# Altium project science-26.PrjPcb
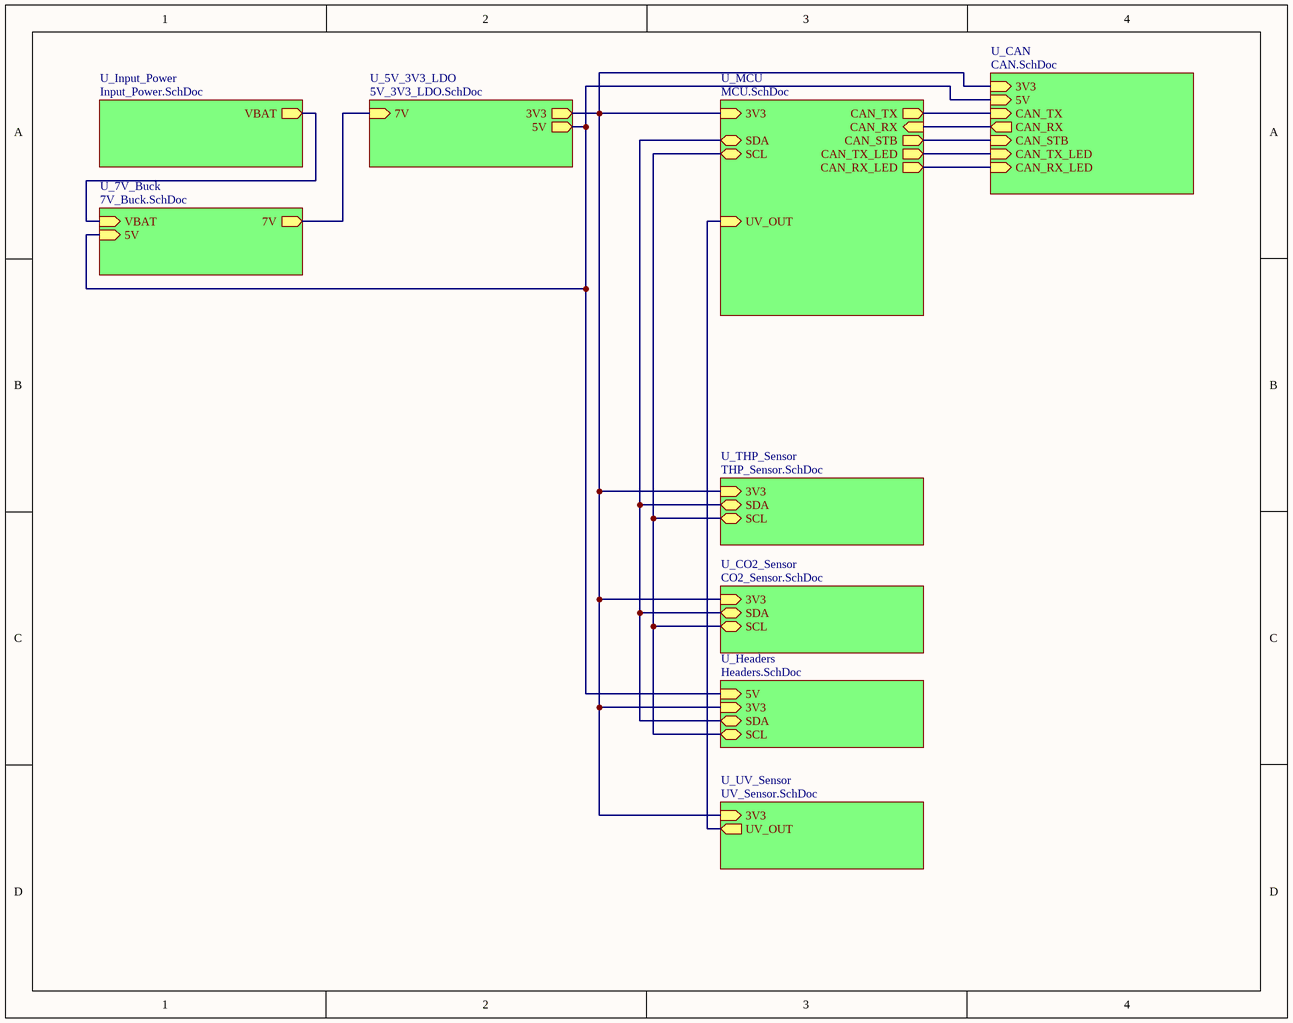
[diagram p0: TLD.SchDoc]
10 sheets, 101 parts. Net scope: hierarchical (ports join the sheet entries above them; power ports are global).
Board file: science-26.PcbDoc
Sheets:
  TLD.SchDoc
    U_5V_3V3_LDO = 5V_3V3_LDO.SchDoc
    U_7V_Buck = 7V_Buck.SchDoc
    U_CAN = CAN.SchDoc
    U_CO2_Sensor = CO2_Sensor.SchDoc
    U_Input_Power = Input_Power.SchDoc
    U_MCU = MCU.SchDoc
    U_THP_Sensor = THP_Sensor.SchDoc
    U_UV_Sensor = UV_Sensor.SchDoc
    U_Headers = Headers.SchDoc

## Sheet TLD.SchDoc
size A; SheetNumber: 1; SheetTotal: 10

### Sub-sheets
U_5V_3V3_LDO = 5V_3V3_LDO.SchDoc: 3V3 (out), 5V (out), 7V (in)
U_7V_Buck = 7V_Buck.SchDoc: 7V (out), VBAT (in), 5V (in)
U_CAN = CAN.SchDoc: CAN_TX (in), CAN_RX (out), CAN_STB (in), CAN_TX_LED (in), CAN_RX_LED (in), 3V3 (in), 5V (in)
U_CO2_Sensor = CO2_Sensor.SchDoc: 3V3 (in), SDA (bidir), SCL (bidir)
U_Headers = Headers.SchDoc: SDA (bidir), SCL (bidir), 3V3 (in), 5V (in)
U_Input_Power = Input_Power.SchDoc: VBAT (out)
U_MCU = MCU.SchDoc: SDA (bidir), SCL (bidir), 3V3 (in), CAN_TX (out), CAN_RX (in), CAN_STB (out), CAN_TX_LED (out), CAN_RX_LED (out), UV_OUT (in)
U_THP_Sensor = THP_Sensor.SchDoc: SDA (bidir), SCL (bidir), 3V3 (in)
U_UV_Sensor = UV_Sensor.SchDoc: 3V3 (in), UV_OUT (out)

### Nets
3V3: sheet U_5V_3V3_LDO/3V3, sheet U_CAN/3V3, sheet U_CO2_Sensor/3V3, sheet U_MCU/3V3, sheet U_THP_Sensor/3V3, sheet U_UV_Sensor/3V3, sheet U_Headers/3V3
5V: sheet U_5V_3V3_LDO/5V, sheet U_7V_Buck/5V, sheet U_CAN/5V, sheet U_Headers/5V
7V: sheet U_5V_3V3_LDO/7V, sheet U_7V_Buck/7V
VBAT: sheet U_7V_Buck/VBAT, sheet U_Input_Power/VBAT
CAN_RX: sheet U_CAN/CAN_RX, sheet U_MCU/CAN_RX
CAN_RX_LED: sheet U_CAN/CAN_RX_LED, sheet U_MCU/CAN_RX_LED
CAN_STB: sheet U_CAN/CAN_STB, sheet U_MCU/CAN_STB
CAN_TX: sheet U_CAN/CAN_TX, sheet U_MCU/CAN_TX
CAN_TX_LED: sheet U_CAN/CAN_TX_LED, sheet U_MCU/CAN_TX_LED
SCL: sheet U_CO2_Sensor/SCL, sheet U_MCU/SCL, sheet U_THP_Sensor/SCL, sheet U_Headers/SCL
SDA: sheet U_CO2_Sensor/SDA, sheet U_MCU/SDA, sheet U_THP_Sensor/SDA, sheet U_Headers/SDA
UV_OUT: sheet U_MCU/UV_OUT, sheet U_UV_Sensor/UV_OUT

## Sheet 5V_3V3_LDO.SchDoc
size A; SheetNumber: 6; SheetTotal: 10
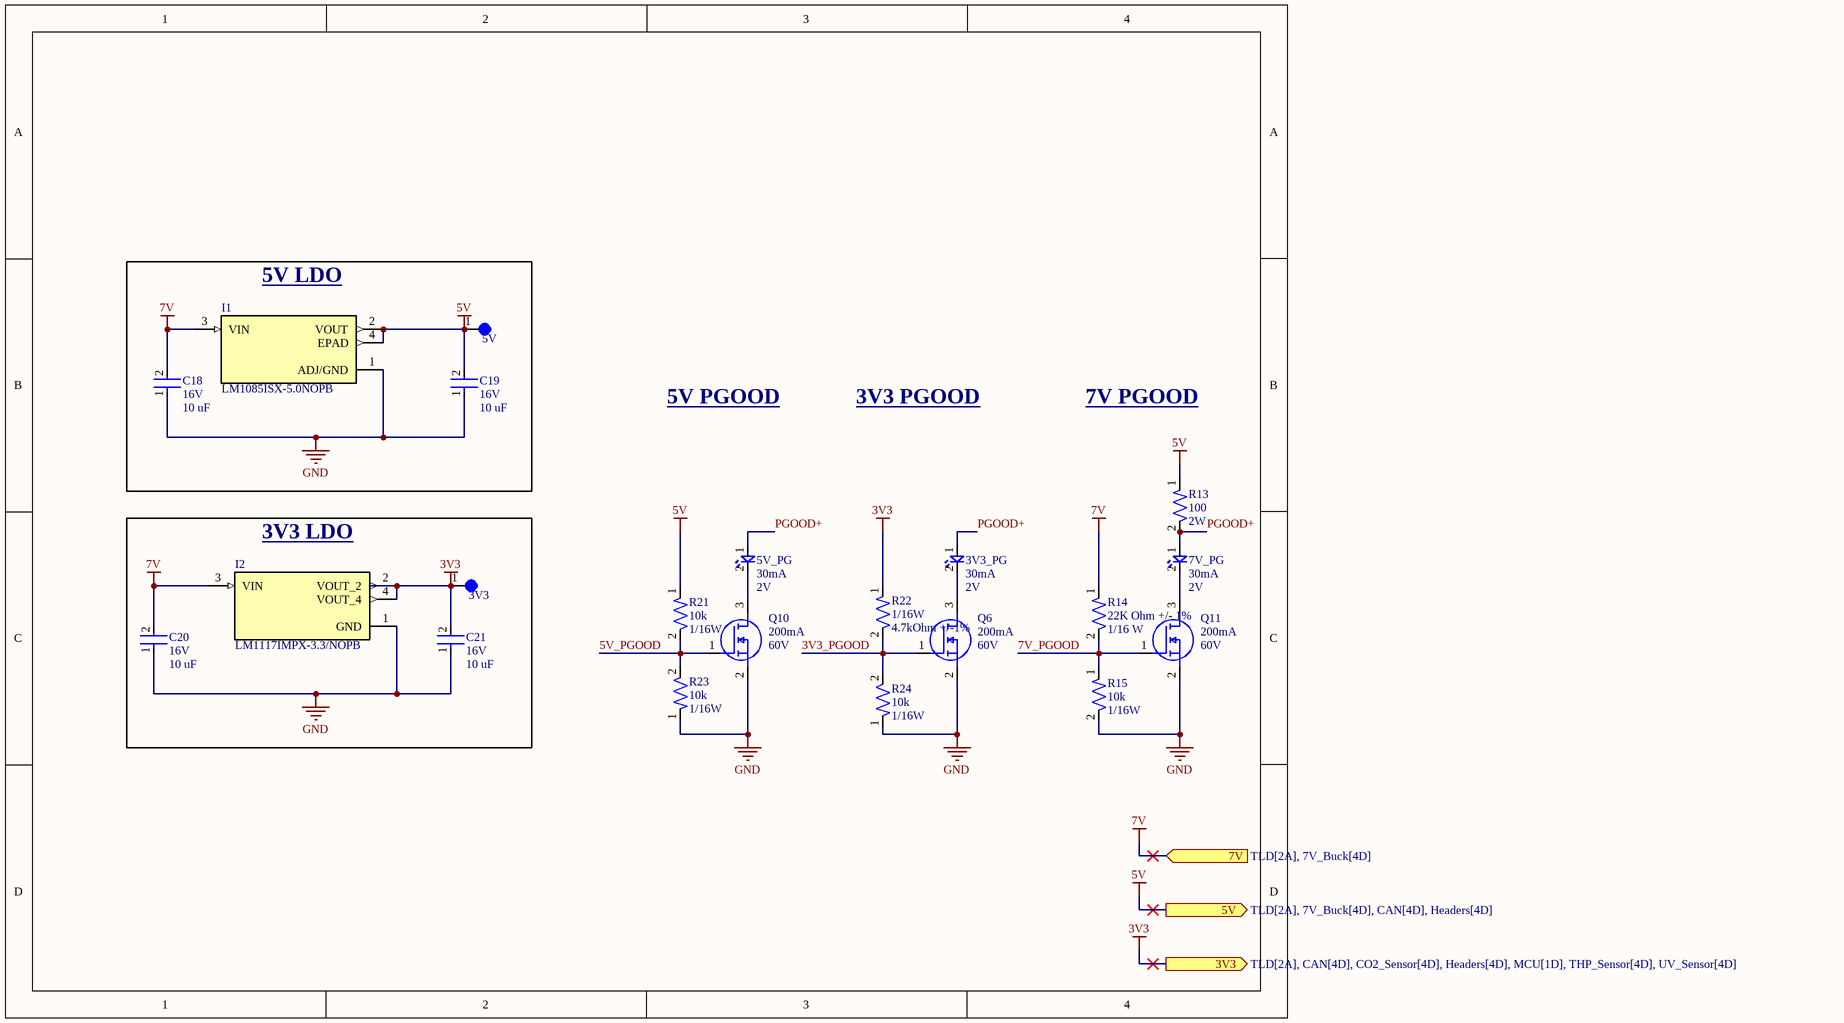
[diagram p1: 5V_3V3_LDO.SchDoc]

### Parts
3V3  5003  [TEST-POINT-0001]  (value not drawn)
3V3_PG  Forward Current: 30mA  Forward Voltage: 2V  [LED-0603]  (hidden comment: BL-HKC36G-AV-TRB)
5V  5003  [TEST-POINT-0001]  (value not drawn)
5V_PG  Forward Current: 30mA  Forward Voltage: 2V  [LED-0603]  (hidden comment: BL-HKC36G-AV-TRB)
7V_PG  Forward Current: 30mA  Forward Voltage: 2V  [LED-0603]  (hidden comment: BL-HKC36G-AV-TRB)
C18  Voltage: 16V  Capacitance: 10 uF  [CAP-1206]  (hidden comment: 293D106X9016A2TE3)
C19  Voltage: 16V  Capacitance: 10 uF  [CAP-1206]  (hidden comment: 293D106X9016A2TE3)
C20  Voltage: 16V  Capacitance: 10 uF  [CAP-1206]  (hidden comment: 293D106X9016A2TE3)
C21  Voltage: 16V  Capacitance: 10 uF  [CAP-1206]  (hidden comment: 293D106X9016A2TE3)
I1  LM1085ISX-5.0NOPB  [IC-TO-263-4]
I2  LM1117IMPX-3.3/NOPB  [IC-SOT-223-4]
Q6  Continuous Current: 200mA  Voltage: 60V  [IC-SOT23-3]  (hidden comment: T2N7002AK,LM)
Q10  Continuous Current: 200mA  Voltage: 60V  [IC-SOT23-3]  (hidden comment: T2N7002AK,LM)
Q11  Continuous Current: 200mA  Voltage: 60V  [IC-SOT23-3]  (hidden comment: T2N7002AK,LM)
R13  Resistance: 100  Power: 2W  [RESC6331X65N]  (hidden comment: SR2512JK-7W100RL)
R14  Resistance: 22K Ohm +/- 1%  Power: 1/16 W  [RES-0402]  (hidden comment: AC0402FR-0722KL)
R15  Resistance: 10k  Power: 1/16W  [RES-0402]  (hidden comment: RC0402FR-0710KL)
R21  Resistance: 10k  Power: 1/16W  [RES-0402]  (hidden comment: RC0402FR-0710KL)
R22  Power Rating: 1/16W  Resistance: 4.7kOhm +/-1%  [RES-0402]  (hidden comment: RC0402FR-074K7P)
R23  Resistance: 10k  Power: 1/16W  [RES-0402]  (hidden comment: RC0402FR-0710KL)
R24  Resistance: 10k  Power: 1/16W  [RES-0402]  (hidden comment: RC0402FR-0710KL)

### Blocks framed on the sheet
5V LDO: 5V C18 C19 I1
3V3 LDO: 3V3 C20 C21 I2

### Ports
3V3 (out, see TLD[2A], CAN[4D], CO2_Sensor[4D], Headers[4D], MCU[1D], THP_Sensor[4D], UV_Sensor[4D]), 5V (out, see TLD[2A], 7V_Buck[4D], CAN[4D], Headers[4D]), 7V (in, see TLD[2A], 7V_Buck[4D])

### Nets
3V3: 3V3.1 C21.2 I2.2(VOUT_2) I2.4(VOUT_4) R22.1 ; port 3V3
5V: 5V.1 C19.2 I1.2(VOUT) I1.4(EPAD) R13.1 R21.1 ; port 5V
7V: C18.2 C20.2 I1.3(VIN) I2.3(VIN) R14.1 ; port 7V
GND: C18.1 C19.1 C20.1 C21.1 I1.1(ADJ/GND) I2.1(GND) Q6.2(S) Q10.2(S) Q11.2(S) R15.2 R23.1 R24.1
3V3_PGOOD: Q6.1(G) R22.2 R24.2
5V_PGOOD: Q10.1(G) R21.2 R23.2
7V_PGOOD: Q11.1(G) R14.2 R15.1
PGOOD+: 3V3_PG.1 5V_PG.1 7V_PG.1 R13.2
Net3V3_PG_2: 3V3_PG.2 Q6.3(D)
Net5V_PG_2: 5V_PG.2 Q10.3(D)
Net7V_PG_2: 7V_PG.2 Q11.3(D)

### Notes on the sheet
- 5V PGOOD
- 3V3 PGOOD
- 7V PGOOD

### Library data of the parts
3V3 5V = TEST-POINT-0001: Oranange PC Test Point, Miniature Phoisphor Bronze Silver Plating Through Hole Mounting Type
3V3_PG 5V_PG 7V_PG = LED-0001: LED YELLOW CLEAR 0603 SMD; ComponentLink1Description: Datasheet; ComponentLink1URL: https://www.americanbrightled.com/pdffiles/led-components/smt/BL-HKC36G-AV-TRB.pdf
C18-C21 = CAP-10U-0004: CAP TANT 10UF 10% 16V 1206; Device Class: Tantalum; Size: 1206; ComponentLink1Description: Datasheet; ComponentLink1URL: https://www.lcsc.com/datasheet/lcsc_datasheet_2304140030_Vishay-Intertech-293D106X9016A2TE3_C110038.pdf
I1 = IC_LDO_5V_0002: IC REG LIN 5V 3A DDPAK/TO263-3; Mfr_Name: Texas Instruments; RefDes: RefDes; Type: Type; ComponentLink1Description: Datasheet; ComponentLink1URL: https://www.ti.com/lit/ds/symlink/lm1085.pdf?HQS=dis-dk-null-digikeymode-dsf-pf-null-wwe&ts=1729859809163&ref_url=https%253A%252F%252Fwww.ti.com%252Fgeneral%252Fdocs%252Fsuppproductinfo.tsp%253FdistId%253D10%2526gotoUrl%253Dhttps%253A%252F%252Fwww.ti.com%252Flit%252Fgpn%252Flm1085
I2 = IC_LDO_3V3_0001: IC REG LIN 3.3V 800MA SOT223-4; ComponentLink1Description: New link; ComponentLink1URL: https://www.ti.com/lit/ds/symlink/lm1117.pdf?HQS=dis-dk-null-digikeymode-dsf-pf-null-wwe&ts=1721700739746
Q6 Q10 Q11 = NMOS-200MA-0001: MOSFET N-CH 60V 200MA SOT23; ComponentLink1Description: Datasheet; ComponentLink1URL: https://toshiba.semicon-storage.com/info/T2N7002AK_datasheet_en_20150401.pdf?did=29712&prodName=T2N7002AK
R13 = RES-100-0002: 100 Ohms ±5% 2W Chip Resistor 2512 (6332 Metric) Automotive AEC-Q200, Pulse Withstanding Thick Film; MF: {'manufacturer': u'YAGEO'}; Package: None; Price: None; Value: *; MP: SR2512JK-7W100RL; Availability: Unavailable; ComponentLink1Description: Datasheet; ComponentLink1URL: https://www.yageogroup.com/content/Resource%20Library/Datasheet/PYU-SR_20105_ROHS_L.pdf
R14 = RES-22K-0002-JLC: 62.5mW Thick Film Resistors 50V ±100ppm/℃ ±1% -55℃~+155℃ 22kΩ 0402  Chip Resistor - Surface Mount ROHS; assembled?: yes; JLC part number: C144778
R15 R21 R23 R24 = RES-10k-0001: RES 10K OHM 1% 1/16W 0402; Tolerance: 1%; Size: 0402; ComponentLink1Description: Datasheet; ComponentLink1URL: https://www.yageo.com/upload/media/product/products/datasheet/rchip/PYu-RC_Group_51_RoHS_L_12.pdf
R22 = RES-4.7K-0001: RES SMD 4.7K OHM 1% 1/16W 0402; Manufacturer: YAGEO; Assembled?: no; Manufacturer Part Number: RC0402FR-074K7P; Package Size: 0402

## Sheet 7V_Buck.SchDoc
size A; SheetNumber: 5; SheetTotal: 10
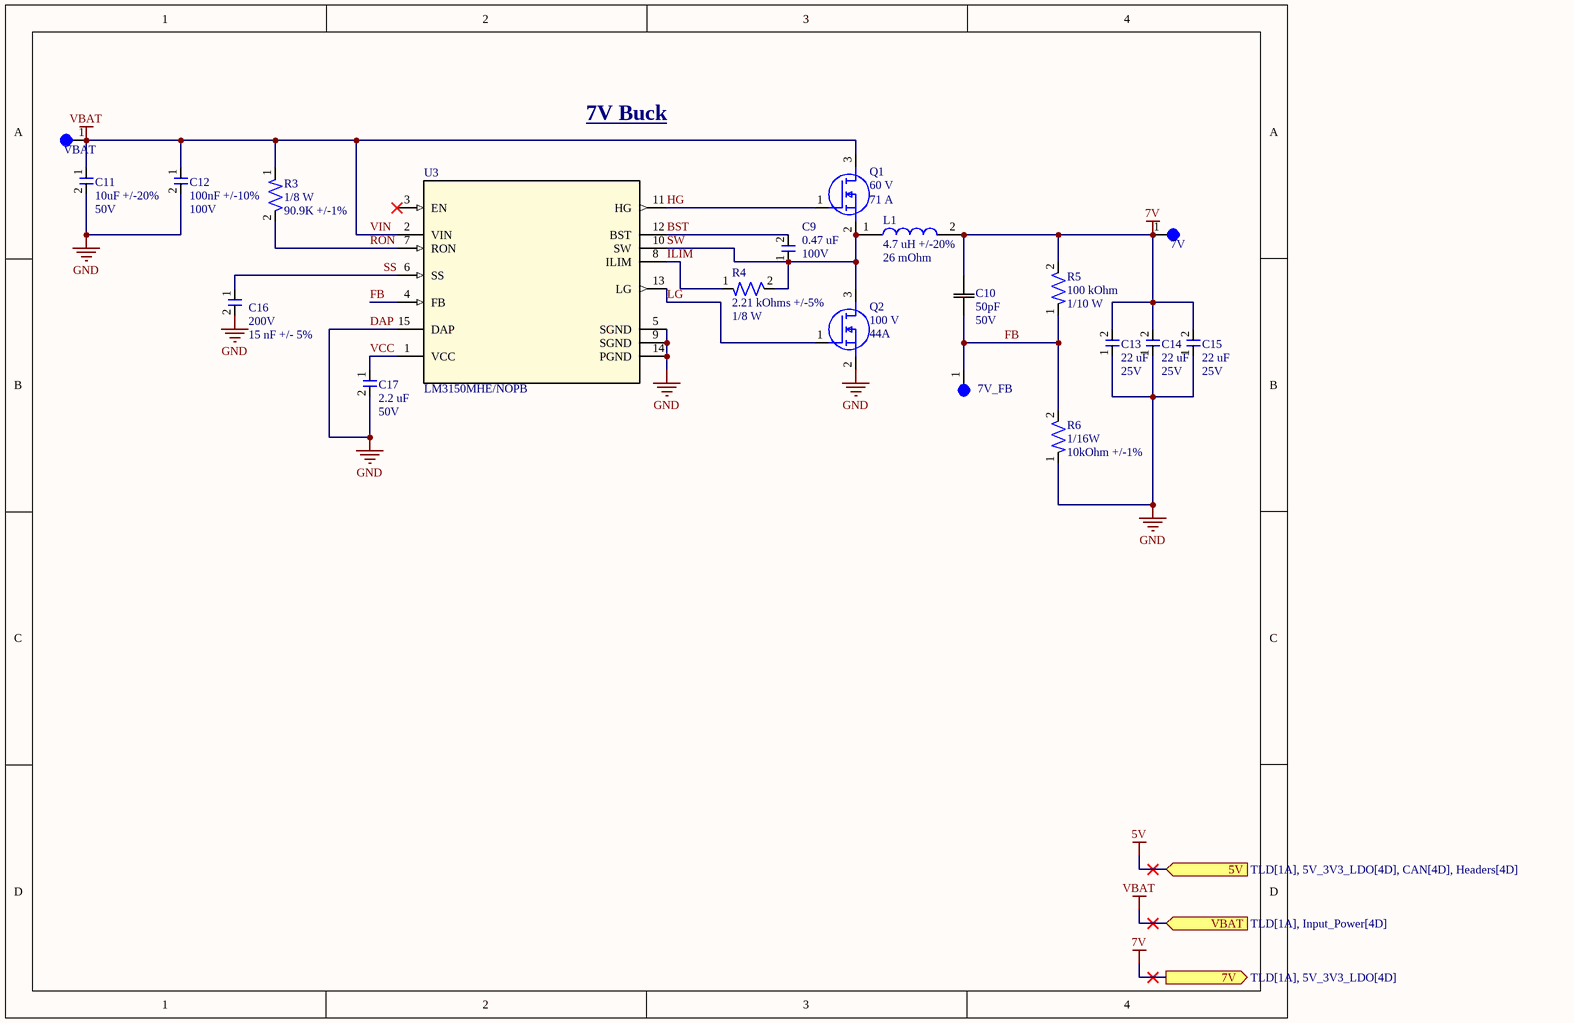
[diagram p2: 7V_Buck.SchDoc]

### Parts
7V  5003  [TEST-POINT-0001]  (value not drawn)
7V_FB  5003  [TEST-POINT-0001]  (value not drawn)
C9  Capacitance: 0.47 uF  Voltage: 100V  [CAP-0805]  (hidden comment: KAM21KR72A474KL)
C10  Capacitance: 50pF  Voltage: 50V  [CAP_CC0402_YAG]  (hidden comment: CC0402JRNPO9BN500)
C11  Capacitance: 10uF +/-20%  Voltage Rating: 50V  [CAP-1206]  (hidden comment: CL31B106KBHNNNE)
C12  Capacitance: 100nF +/-10%  Voltage Rating: 100V  [CAP-0603]  (hidden comment: CC0603KRX7R0BB104)
C13  Capacitance: 22 uF  Voltage: 25V  [CAP-1210]  (hidden comment: CL32B226KAJNNNE)
C14  Capacitance: 22 uF  Voltage: 25V  [CAP-1210]  (hidden comment: CL32B226KAJNNNE)
C15  Capacitance: 22 uF  Voltage: 25V  [CAP-1210]  (hidden comment: CL32B226KAJNNNE)
C16  Parameter 2: 200V  Parameter 1: 15 nF +/- 5%  [CAP-1206]  (hidden comment: GMC31CG153J200NT)
C17  Capacitance: 2.2 uF  oltage: 50V  [CAP-0603]  (hidden comment: UMK107BBJ225KA-T)
L1  Inductance: 4.7 uH +/-20%  DCR: 26 mOhm  [PWRIND-4.7U-0001]  (hidden comment: SRN6045TA-4R7M)
Q1  Max Voltage: 60 V  Max Current: 71 A  [NTMFS5C670NLT1G_ONS]  (hidden comment: NTMFS5C670NLT1G)
Q2  Voltage Max: 100 V  Current Max: 44A  [TRANS_CSD19534Q5A]  (hidden comment: CSD19534Q5A)
R3  Parameter 2: 1/8 W  Parameter 1: 90.9K +/-1%  [RES-0402]  (hidden comment: AC0402FR-7W90K9L)
R4  Resistance: 2.21 kOhms +/-5%  Power: 1/8 W  [RES-0805]  (hidden comment: RT0805BRD072K21L)
R5  Resistance: 100 kOhm  Power: 1/10 W  [RES-0603]  (hidden comment: RC0603FR-07100KL)
R6  Power Rating: 1/16W  Resistance: 10kOhm +/-1%  [RES-0402]  (hidden comment: RC0402FR-0710KL)
U3  LM3150MHE/NOPB  [MXA14A]
VBAT  5003  [TEST-POINT-0001]  (value not drawn)

### Ports
5V (in, see TLD[1A], 5V_3V3_LDO[4D], CAN[4D], Headers[4D]), 7V (out, see TLD[1A], 5V_3V3_LDO[4D]), VBAT (in, see TLD[1A], Input_Power[4D])

### Nets
7V: 7V.1 C10.2 C13.2 C14.2 C15.2 L1.2 R5.2 ; port 7V
GND: C11.2 C12.2 C13.1 C14.1 C15.1 C16.2 C17.2 Q2.2(S) R6.1 U3.5(SGND) U3.9(SGND) U3.14(PGND) U3.15(DAP)  [also labelled DAP]
VBAT: C11.1 C12.1 Q1.3(D) R3.1 U3.2(VIN) VBAT.1 ; port VBAT  [also labelled VIN]
BST: C9.2 U3.12(BST)
FB: 7V_FB.1 C10.1 R5.1 R6.2 U3.4(FB)
HG: Q1.1(G) U3.11(HG)
ILIM: R4.1 U3.8(ILIM)
LG: Q2.1(G) U3.13(LG)
RON: R3.2 U3.7(RON)
SS: C16.1 U3.6(SS)
SW: C9.1 L1.1 Q1.2(S) Q2.3(D) R4.2 U3.10(SW)
VCC: C17.1 U3.1(VCC)

Not connected (* = marked no-connect by the designer): U3 3(EN)*

### Notes on the sheet
- 7V Buck

### Library data of the parts
7V 7V_FB VBAT = TEST-POINT-0001: as 3V3 on sheet 5V_3V3_LDO
C9 = CAP-0.47U-0001: 0.47 µF ±10% 100V Ceramic Capacitor X7R 0805 (2012 Metric); Tolerance: +/- 10%; Assembled?: No; Temperature Coefficient: X7R; Package Size: 0805
C10 = CAP-50p: 50 pF ±5% 50V Ceramic Capacitor C0G, NP0 0402 (1005 Metric); Manufacturer_Name: Yageo; Copyright: Copyright (C) 2025 Ultra Librarian. All rights reserved.; Manufacturer_Part_Number: CC0402JRNPO9BN500; ComponentLink1Description: Datasheet; ComponentLink1URL: https://www.yageo.com/en/Chart/Download/pdf/CC0402JRNPO9BN500
C11 = CAP-10U-0001: 10 µF ±10% 50V Ceramic Capacitor X7R 1206 (3216 Metric); Manufacturer: Samsung Electro-Mechanics; Assembled?: no; Manufacturer Part Number: CL31B106KBHNNNE; Temperature Coefficient: X7R; Package Size: 1206
C12 = CAP-100N-0001: CAP CER 0.1UF 100V X7R 0603; Manufacturer: YAGEO; Assembled?: no; Manufacturer Part Number: CC0603KRX7R0BB104; Temperature Coefficient: X7R; Package Size: 0603
C13-C15 = CAP-22U-0003: 22 µF ±10% 25V Ceramic Capacitor X7R 1210 (3225 Metric); Tolerance: +/- 10%; Assembled?: No; Temperature Coefficient: X7R; Package Size: 1210
C16 = CAP-15N-0001: 0.015 µF ±5% 200V Ceramic Capacitor C0G, NP0 1206 (3216 Metric)
C17 = CAP-2.2U-0001: 2.2 µF ±10% 50V Ceramic Capacitor X5R 0603 (1608 Metric)
L1 = PWRIND-4.7U-0001: 4.7 µH Semi-Shielded Drum Core, Wirewound Inductor 4.5 A 26mOhm Nonstandard; Saturation Current: 6.8A; Current Rating: 4.5A
Q1 = NMOS-71A-0001: N-Channel 60 V 17A (Ta), 71A (Tc) 3.6W (Ta), 61W (Tc) Surface Mount 5-DFN (5x6) (8-SOFL); Manufacturer_Name: onsemi; Copyright: Copyright (C) 2025 Ultra Librarian. All rights reserved.; Manufacturer_Part_Number: NTMFS5C670NLT1G; RefDes: RefDes; Type: Type
Q2 = NMOS-44A-0001: N-Channel 100 V 44A (Tc) 3.2W (Ta), 63W (Tc) Surface Mount 8-VSONP (5x6); MF: Texas Instruments; Mouser-Purchase-URL: https://snapeda.com/shop?store=Mouser&id=485742; Package: VSONP-8 Texas Instruments; Texas_Instruments-Purchase-URL: https://snapeda.com/shop?store=Texas+Instruments&id=485742; Value: *; Price: None; DigiKey-Purchase-URL: https://snapeda.com/shop?store=DigiKey&id=485742; MP: CSD19534Q5A; SnapEDA_Link: https://www.snapeda.com/parts/CSD19534Q5A/Texas%20Instruments/view-part/485742/?ref=snap; Availability: Good
R3 = RES-90.9K-0001: 90.9 kOhms ±1% 0.125W, 1/8W Chip Resistor 0402 (1005 Metric) Automotive AEC-Q200, Moisture Resistant Thick Film
R4 = RES-2.21K-0001: 2.21 kOhms ±0.1% 0.125W, 1/8W Chip Resistor 0805 (2012 Metric) Thin Film
R5 = RES-100K-0003: 100 kOhms ±1% 0.1W, 1/10W Chip Resistor 0603 (1608 Metric) Moisture Resistant Thick Film; Tolerance: +/- 1%; Assembled?: No; Package Size: 0603
R6 = RES-10K-0001: RES 10K OHM 1% 1/16W 0402; Manufacturer: YAGEO; Assembled?: no; Manufacturer Part Number: RC0402FR-0710KL; Package Size: 0402
U3 = IC-BUCK_0011: 6V to 42V Synchronous Step-Down Controller with Adjustable Output Voltage 14-HTSSOP -40 to 125; Manufacturer_Name: Texas Instruments; Copyright: Copyright (C) 2025 Ultra Librarian. All rights reserved.; Manufacturer_Part_Number: LM3150MHE/NOPB; Datasheet: https://www.ti.com/lit/gpn/lm3150; RefDes: RefDes; Type: Type

## Sheet CAN.SchDoc
size A; SheetNumber: 3; SheetTotal: 10
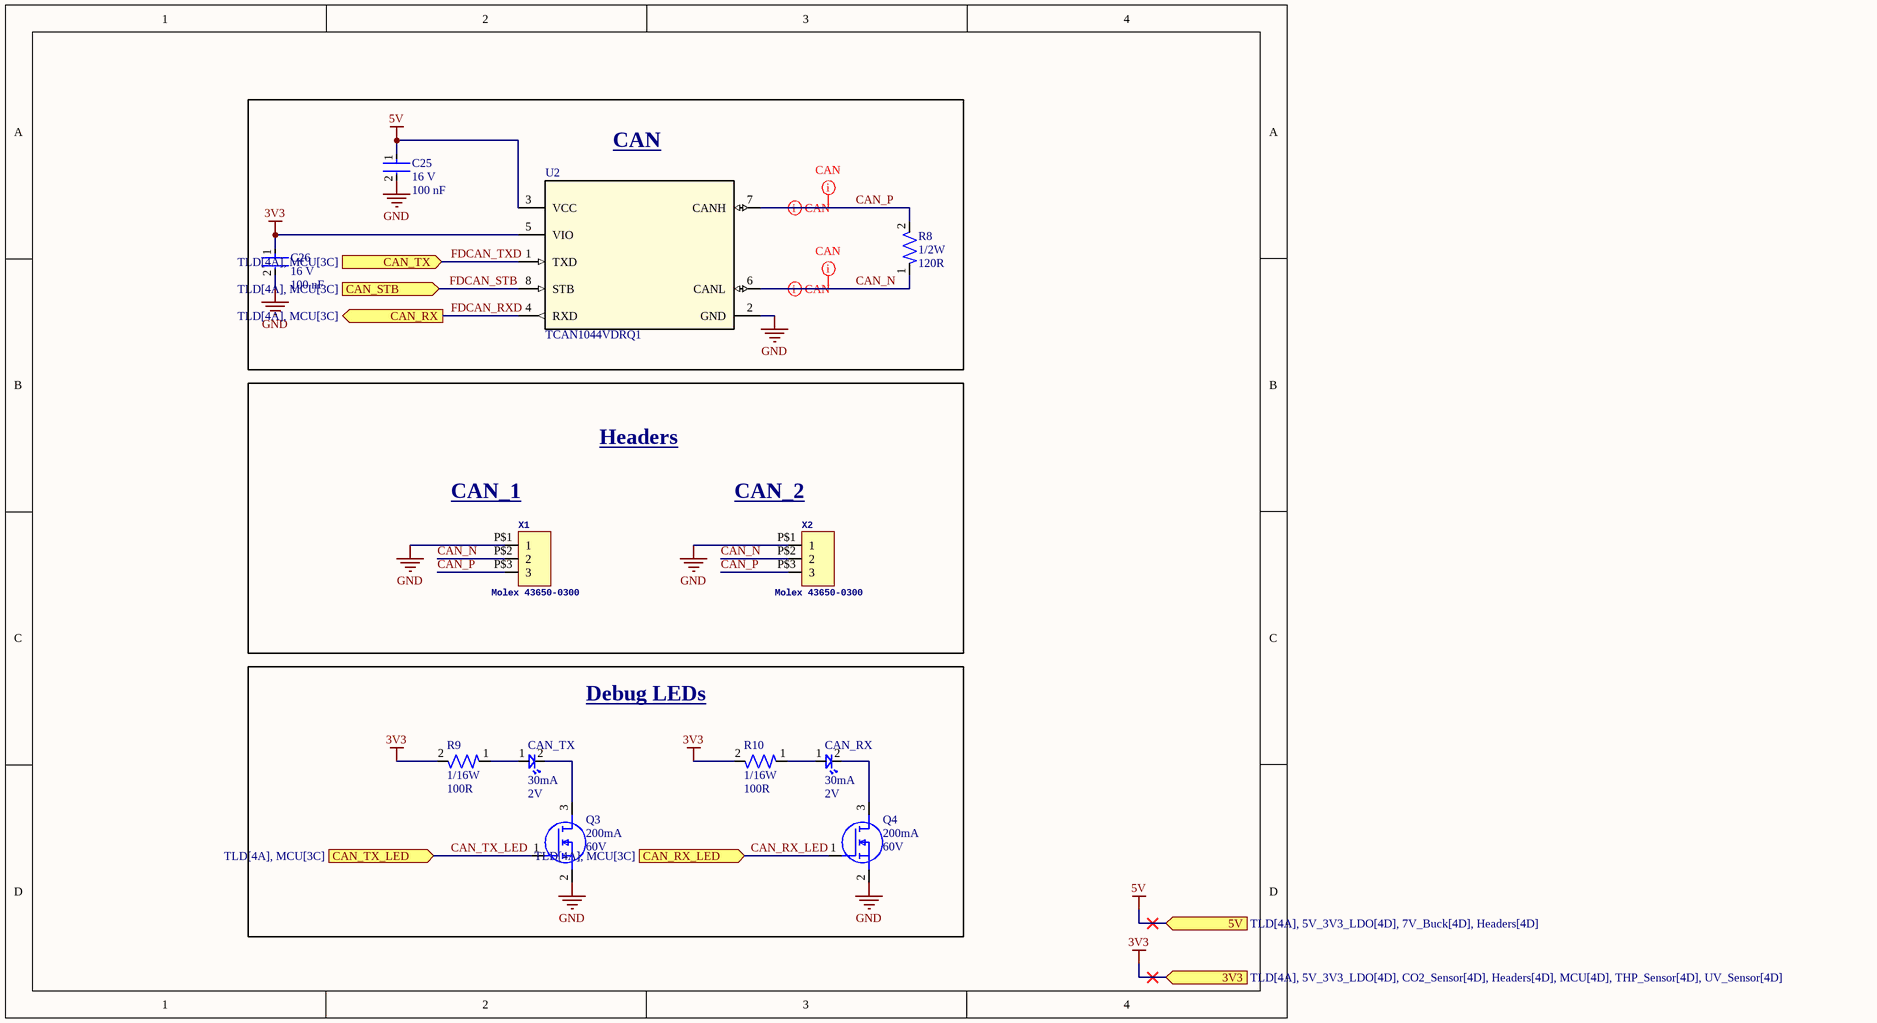
[diagram p3: CAN.SchDoc]

### Parts
C25  Voltage Rating: 16 V  Capacitance: 100 nF  [CAP-0402]  (hidden comment: CC0402KRX7R7BB104)
C26  Voltage Rating: 16 V  Capacitance: 100 nF  [CAP-0402]  (hidden comment: CC0402KRX7R7BB104)
CAN_RX  Forward Current: 30mA  Forward Voltage: 2V  [LED-0603]  (hidden comment: BL-HKC36G-AV-TRB)
CAN_TX  Forward Current: 30mA  Forward Voltage: 2V  [LED-0603]  (hidden comment: BL-HKC36G-AV-TRB)
Q3  Continuous Current: 200mA  Voltage: 60V  [IC-SOT23-3]  (hidden comment: T2N7002AK,LM)
Q4  Continuous Current: 200mA  Voltage: 60V  [IC-SOT23-3]  (hidden comment: T2N7002AK,LM)
R8  Power: 1/2W  Resistance: 120R  [RES-1210]  (hidden comment: RC1210FR-07120RL)
R9  Power: 1/16W  Resistance: 100R  [RES-0402]  (hidden comment: RC0402FR-07100RL)
R10  Power: 1/16W  Resistance: 100R  [RES-0402]  (hidden comment: RC0402FR-07100RL)
U2  TCAN1044VDRQ1  [IC-8SOIC]
X1  Molex 43650-0300  [43650-0300]
X2  Molex 43650-0300  [43650-0300]

### Blocks framed on the sheet
CAN: C25 C26 R8 U2
Debug LEDs: CAN_RX CAN_TX Q3 Q4 R9 R10

### Ports
3V3 (in, see TLD[4A], 5V_3V3_LDO[4D], CO2_Sensor[4D], Headers[4D], MCU[4D], THP_Sensor[4D], UV_Sensor[4D]), 5V (in, see TLD[4A], 5V_3V3_LDO[4D], 7V_Buck[4D], Headers[4D]), CAN_RX (out, see TLD[4A], MCU[3C]), CAN_RX_LED (in, see TLD[4A], MCU[3C]), CAN_STB (in, see TLD[4A], MCU[3C]), CAN_TX (in, see TLD[4A], MCU[3C]), CAN_TX_LED (in, see TLD[4A], MCU[3C])

### Nets
3V3: C26.1 R9.2 R10.2 U2.5(VIO) ; port 3V3
5V: C25.1 U2.3(VCC) ; port 5V
GND: C25.2 C26.2 Q3.2(S) Q4.2(S) U2.2(GND) X1.P$1(1) X2.P$1(1)
CAN_N: R8.1 U2.6(CANL) X1.P$2(2) X2.P$2(2)
CAN_P: R8.2 U2.7(CANH) X1.P$3(3) X2.P$3(3)
CAN_RX_LED: Q4.1(G) ; port CAN_RX_LED
CAN_TX_LED: Q3.1(G) ; port CAN_TX_LED
FDCAN_RXD: U2.4(RXD) ; port CAN_RX  [project net CAN_RX]
FDCAN_STB: U2.8(STB) ; port CAN_STB  [project net CAN_STB]
FDCAN_TXD: U2.1(TXD) ; port CAN_TX  [project net CAN_TX]
NetCAN_RX_1: CAN_RX.1 R10.1
NetCAN_RX_2: CAN_RX.2 Q4.3(D)
NetCAN_TX_1: CAN_TX.1 R9.1
NetCAN_TX_2: CAN_TX.2 Q3.3(D)

### Layout directives
differential pair; differential pair class CAN: CAN_N, CAN_P
net class CAN: CAN_N, CAN_P

### Notes on the sheet
- (near X1) CAN_1
- Headers
- (near X2) CAN_2

### Library data of the parts
C25 C26 = CAP-0.1U-0001: CAP CER 0.1UF 16V X7R 0402; ComponentLink2Description: Datasheet; ComponentLink2URL: https://www.yageo.com/upload/media/product/productsearch/datasheet/mlcc/UPY-GPHC_X7R_6.3V-to-250V_24.pdf; Device Class: Ceramic; Size: 0402
CAN_RX CAN_TX = LED-0001: LED YELLOW CLEAR 0603 SMD; ComponentLink1Description: Datasheet; ComponentLink1URL: https://www.americanbrightled.com/pdffiles/led-components/smt/BL-HKC36G-AV-TRB.pdf
Q3 Q4 = NMOS-200MA-0001: MOSFET N-CH 60V 200MA SOT23; ComponentLink1Description: Datasheet; ComponentLink1URL: https://toshiba.semicon-storage.com/info/T2N7002AK_datasheet_en_20150401.pdf?did=29712&prodName=T2N7002AK
R8 = RES-120-0001: RES 120 OHM 1% 1/2W 1210; Tolerance: 1%; Size: 1210; ComponentLink1Description: Datasheet; ComponentLink1URL: https://www.yageo.com/upload/media/product/products/datasheet/rchip/PYu-RC_Group_51_RoHS_L_12.pdf
R9 R10 = RES-100-0001: RES 100 OHM 1% 1/16W 0402; Tolerance: 1%; Size: 0402; ComponentLink1Description: Datasheet; ComponentLink1URL: https://www.yageo.com/upload/media/product/products/datasheet/rchip/PYu-RC_Group_51_RoHS_L_12.pdf
U2 = IC-CAN-0001: IC TRANSCEIVER 1/1 8SOIC; ComponentLink1Description: Datasheet; ComponentLink1URL: https://www.ti.com/lit/ds/symlink/tcan1044-q1.pdf?HQS=dis-dk-null-digikeymode-dsf-pf-null-wwe&ts=1728758303289&ref_url=https%253A%252F%252Fwww.ti.com%252Fgeneral%252Fdocs%252Fsuppproductinfo.tsp%253FdistId%253D10%2526gotoUrl%253Dhttps%253A%252F%252Fwww.ti.com%252Flit%252Fgpn%252Ftcan1044-q1
X1 X2 = Micro-Fit Molex 3 Pin Right Angle: GateName_1: G$1; SymbolName_1: HEADER_POS3; DeviceSetName: HEADER_POS3_?; DeviceName: 43650-0300; LibraryName: con-molex-micro-fit-3_0_2; Package: 43650-0300

## Sheet CO2_Sensor.SchDoc
size A; SheetNumber: 8; SheetTotal: 10
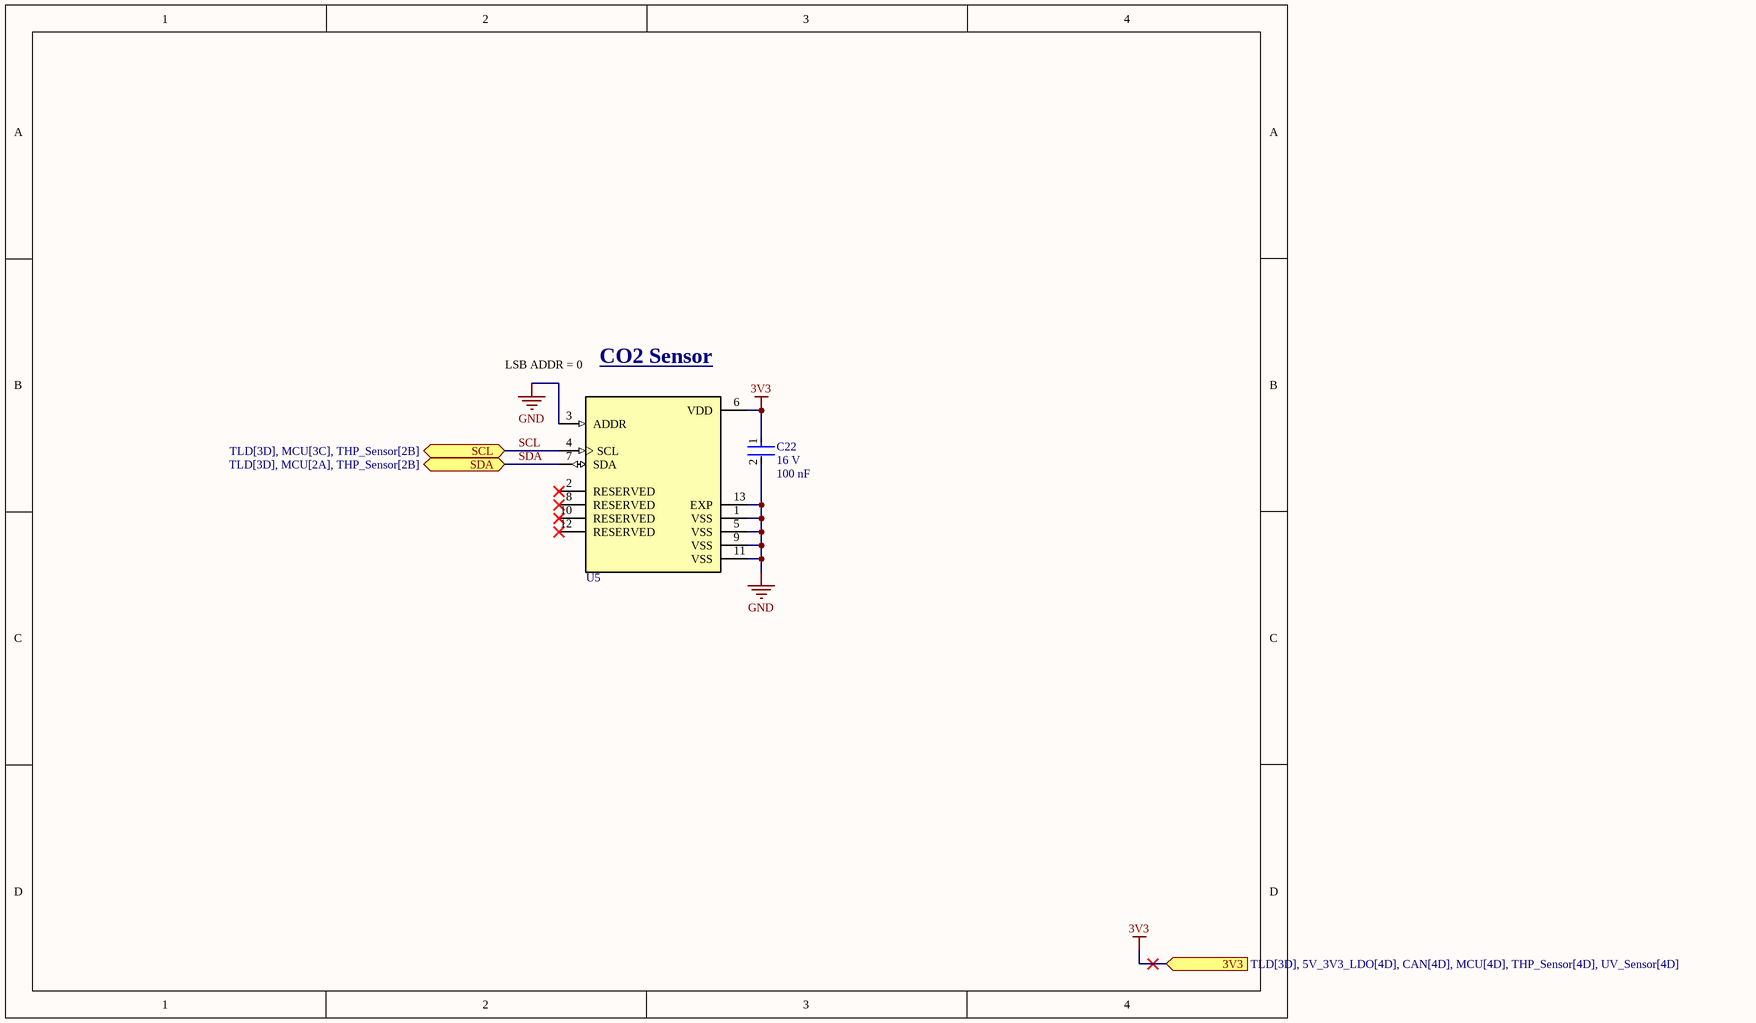
[diagram p4: CO2_Sensor.SchDoc]

### Parts
C22  Voltage Rating: 16 V  Capacitance: 100 nF  [CAP-0402]  (hidden comment: CC0402KRX7R7BB104)
U5  STC31-C-R3  [XDCR_STC31-C-R3]  (value not drawn)

### Ports
3V3 (in, see TLD[3D], 5V_3V3_LDO[4D], CAN[4D], MCU[4D], THP_Sensor[4D], UV_Sensor[4D]), SCL (bidir, see TLD[3D], MCU[3C], THP_Sensor[2B]), SDA (bidir, see TLD[3D], MCU[2A], THP_Sensor[2B])

### Nets
3V3: C22.1 U5.6(VDD) ; port 3V3
GND: C22.2 U5.1(VSS) U5.3(ADDR) U5.5(VSS) U5.9(VSS) U5.11(VSS) U5.13(EXP)
SCL: U5.4(SCL) ; port SCL
SDA: U5.7(SDA) ; port SDA

Not connected (* = marked no-connect by the designer): U5 2(RESERVED)* 8(RESERVED)* 10(RESERVED)* 12(RESERVED)*

### Notes on the sheet
- (near U5) LSB ADDR = 0
- (near U5) CO2 Sensor

### Library data of the parts
C22 = CAP-0.1U-0001: CAP CER 0.1UF 16V X7R 0402; ComponentLink2Description: Datasheet; ComponentLink2URL: https://www.yageo.com/upload/media/product/productsearch/datasheet/mlcc/UPY-GPHC_X7R_6.3V-to-250V_24.pdf; Device Class: Ceramic; Size: 0402
U5 = SENS-CO2: SENSOR CARBON DIOXIDE I2C OUTPUT; MF: Sensirion; SnapEDA_Link: https://www.snapeda.com/parts/STC31-C-R3/Sensirion/view-part/?ref=snap; Package: Package; Value: *; MP: STC31-C-R3; Check_prices: https://www.snapeda.com/parts/STC31-C-R3/Sensirion/view-part/?ref=eda; ComponentLink1Description: Datasheet; ComponentLink1URL: https://sensirion.com/media/documents/D9F76A0F/686E30AC/TC_DS_STC31-C_D1.pdf

## Sheet Input_Power.SchDoc
size A; SheetNumber: 4; SheetTotal: 10
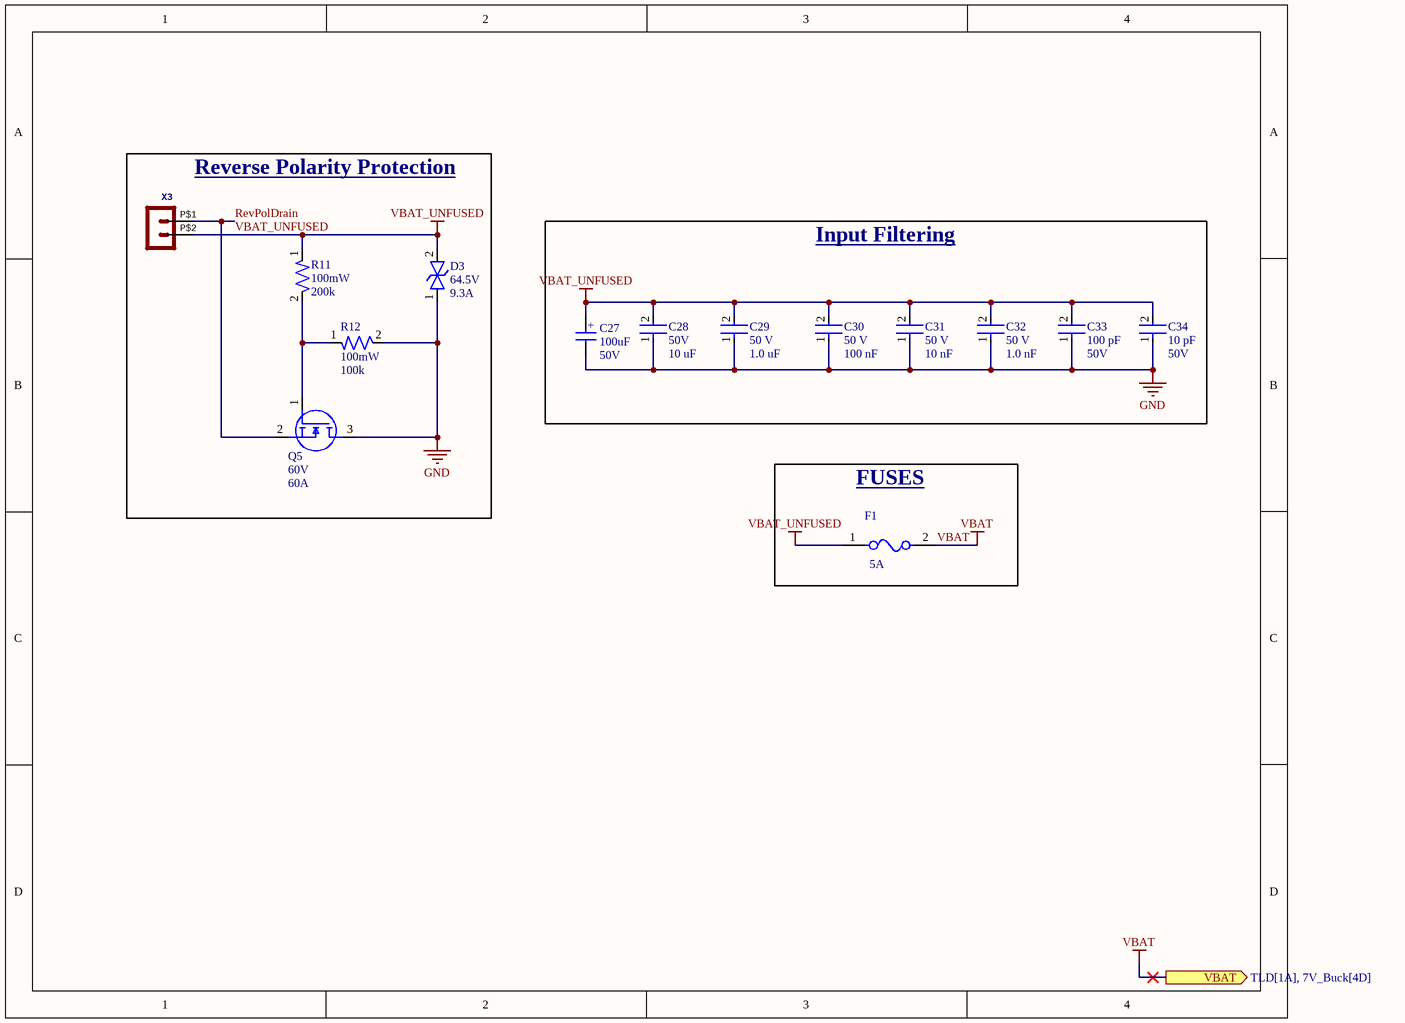
[diagram p5: Input_Power.SchDoc]

### Parts
C27  Capacitance: 100uF  Voltage: 50V  [WCAP-ATUL_8X11.5(DXL)]  (hidden comment: 860040674004)
C28  Voltage: 50V  Capacitance: 10 uF  [CAP-1210]  (hidden comment: CL32B106KBJNNNE)
C29  Voltage: 50 V  Capacitance: 1.0 uF  [CAP-0805]  (hidden comment: CC0805KKX7R9BB105)
C30  Voltage Rating: 50 V  Capacitance: 100 nF  [CAP-0805]  (hidden comment: CC0805KRX7R9BB104)
C31  Voltage: 50 V  Capacitance: 10 nF  [CAP-0603]  (hidden comment: CC0603KPX7R9BB103)
C32  Voltage: 50 V  Capacitance: 1.0 nF  [CAP-0402]  (hidden comment: CC0402KRX7R9BB102)
C33  Capacitance: 100 pF  Voltage: 50V  [CAP-0402]  (hidden comment: CC0402JRNPO9BN101)
C34  Capacitance: 10 pF  Voltage: 50V  [CAP-0402]  (hidden comment: CC0402JRNPO9BN100)
D3  Voltage Rating: 64.5V  Current Rating: 9.3A  [DO-214AA (SMBJ)]  (hidden comment: SMBJ40CA)
F1  Fuse Current: 5A  [FUSE-0001]  (hidden comment: 01550900M)
Q5  Voltage: 60V  Continuous Current: 60A  [IC-8VSONCLIP]  (hidden comment: CSD18543Q3AT)
R11  Power: 100mW  Resistance: 200k  [RES-0603]  (hidden comment: RC0603FR-07200KL)
R12  Power: 100mW  Resistance: 100k  [RES-0603]  (hidden comment: RC0603FR-07100KL)
X3  Molex - Micro-Fit 3.0 Series connector,  3.00mm (0.118") pitch header, 2 positions.  [43045-0200]  (value not drawn)

### Blocks framed on the sheet
Reverse Polarity Protection: D3 Q5 R11 R12 X3
Input Filtering: C27-C34
FUSES: F1

### Ports
VBAT (out, see TLD[1A], 7V_Buck[4D])

### Nets
GND: C27.2(NEG) C28.1 C29.1 C30.1 C31.1 C32.1 C33.1 C34.1 D3.1 Q5.3(D) R12.2
VBAT: F1.2 ; port VBAT
VBAT_UNFUSED: C27.1(POS) C28.2 C29.2 C30.2 C31.2 C32.2 C33.2 C34.2 D3.2 F1.1 R11.1 X3.P$2
RevPolDrain: Q5.2(S) X3.P$1
NetQ5_1: Q5.1(G) R11.2 R12.1

### Notes on the sheet
- (in symbol CAP-100U-0002_1) +

### Library data of the parts
C27 = CAP-100U-0002_1: 100 µF 50 V Aluminum Electrolytic Capacitors Radial, Can 7000 Hrs @ 105°C; MF: {'manufacturer': u'W\xfcrth Elektronik'}; Package: None; Price: None; MP: 860040674004; Availability: Unavailable; ComponentLink1Description: Datasheet; ComponentLink1URL: https://www.we-online.com/components/products/datasheet/860040674004.pdf
C28 = CAP-10U-0002: CAP CER 10UF 50V X7R 1210; Device Class: Ceramic; Size: 1210; ComponentLink1Description: Datasheet; ComponentLink1URL: https://mm.digikey.com/Volume0/opasdata/d220001/medias/docus/41/CL32B106KBJNNNE_Spec.pdf
C29 = CAP-1U-0001: CAP CER 1UF 50V X7R 0805; ComponentLink2URL: https://www.yageo.com/upload/media/product/productsearch/datasheet/mlcc/UPY-GPHC_X7R_6.3V-to-250V_24.pdf; ComponentLink2Description: Datasheet; Device Class: Ceramic; Size: 0805
C30 = CAP-0.1U-0002: CAP CER 0.1UF 50V X7R 0805; ComponentLink2Description: Datasheet; ComponentLink2URL: https://www.yageo.com/upload/media/product/productsearch/datasheet/mlcc/UPY-GPHC_X7R_6.3V-to-250V_24.pdf; Device Class: Ceramic; Size: 0805
C31 = CAP-10N-0002: CAP CER 10000PF 50V X7R 0603; ComponentLink2Description: Datasheet; ComponentLink2URL: http://www.yageo.com/documents/recent/UPY-GPHC_X7R_6.3V-to-50V_18.pdf; Device Class: Ceramic; Size: 0603
C32 = CAP-1N-0001: CAP CER 1000PF 50V X7R 0402; ComponentLink2Description: Datasheet; ComponentLink2URL: http://www.yageo.com/documents/recent/UPY-GP_NP0_16V-to-50V_16.pdf; Device Class: Ceramic; Size: 0402
C33 = CAP-100P-0001: CAP CER 100PF 50V C0G/NPO 0402; Device Class: Ceramic; Size: 0402; ComponentLink1Description: Datasheet; ComponentLink1URL: https://www.yageo.com/upload/media/product/productsearch/datasheet/mlcc/UPY-GP_NP0_16V-to-50V_18.pdf
C34 = CAP-10P-0001: CAP CER 10PF 50V C0G/NPO 0402; Device Class: Ceramic; Size: 0402; ComponentLink1Description: Datasheet; ComponentLink1URL: https://www.yageo.com/upload/media/product/productsearch/datasheet/mlcc/UPY-GP_NP0_16V-to-50V_18.pdf
D3 = DIO-TVS-0001: TVS DIODE 40VWM 64.5VC DO214AA; ComponentLink1Description: Datasheet; ComponentLink1URL: https://www.littelfuse.com/media?resourcetype=datasheets&itemid=09a6ae9a-73cb-4ac4-acac-e6dab92ab953&filename=littelfuse_tvs_diode_smbj_datasheet.pdf
F1 = FUSE-0001: FUSE BLOK CARTRIDGE 125V 10A SMD; ComponentLink2Description: Datasheet; ComponentLink2URL: https://www.littelfuse.com/~/media/electronics/datasheets/fuses/littelfuse_fuse_154_154t_154l_154tl_datasheet.pdf.pdf; Voltage Rating: 125V
Q5 = NMOS-60A-0001: MOSFET N-CH 60V 12A/60A 8VSON; ComponentLink2Description: Datasheet; ComponentLink2URL: http://www.ti.com/lit/ds/symlink/csd18543q3a.pdf
R11 = RES-200k-0001: RES SMD 200K OHM 1% 1/10W 0603; Tolerance: 1%; Size: 0603; ComponentLink1Description: Datasheet; ComponentLink1URL: https://www.yageo.com/upload/media/product/products/datasheet/rchip/PYu-RC_Group_51_RoHS_L_12.pdf
R12 = RES-100k-0001: RES SMD 100K OHM 1% 1/10W 0603; Tolerance: 1%; Size: 0603; ComponentLink1Description: Datasheet; ComponentLink1URL: https://www.yageo.com/upload/media/product/products/datasheet/rchip/PYu-RC_Group_51_RoHS_L_12.pdf
X3 = HEADER_POS2_?43045-0200: GateName_1: G$1; SymbolName_1: HEADER_POS2; DeviceName: 43045-0200; LibraryName: con-molex-micro-fit-3_0_2; DeviceSetName: HEADER_POS2_?; Package: 43045-0200

## Sheet MCU.SchDoc
size A; SheetNumber: 2; SheetTotal: 10
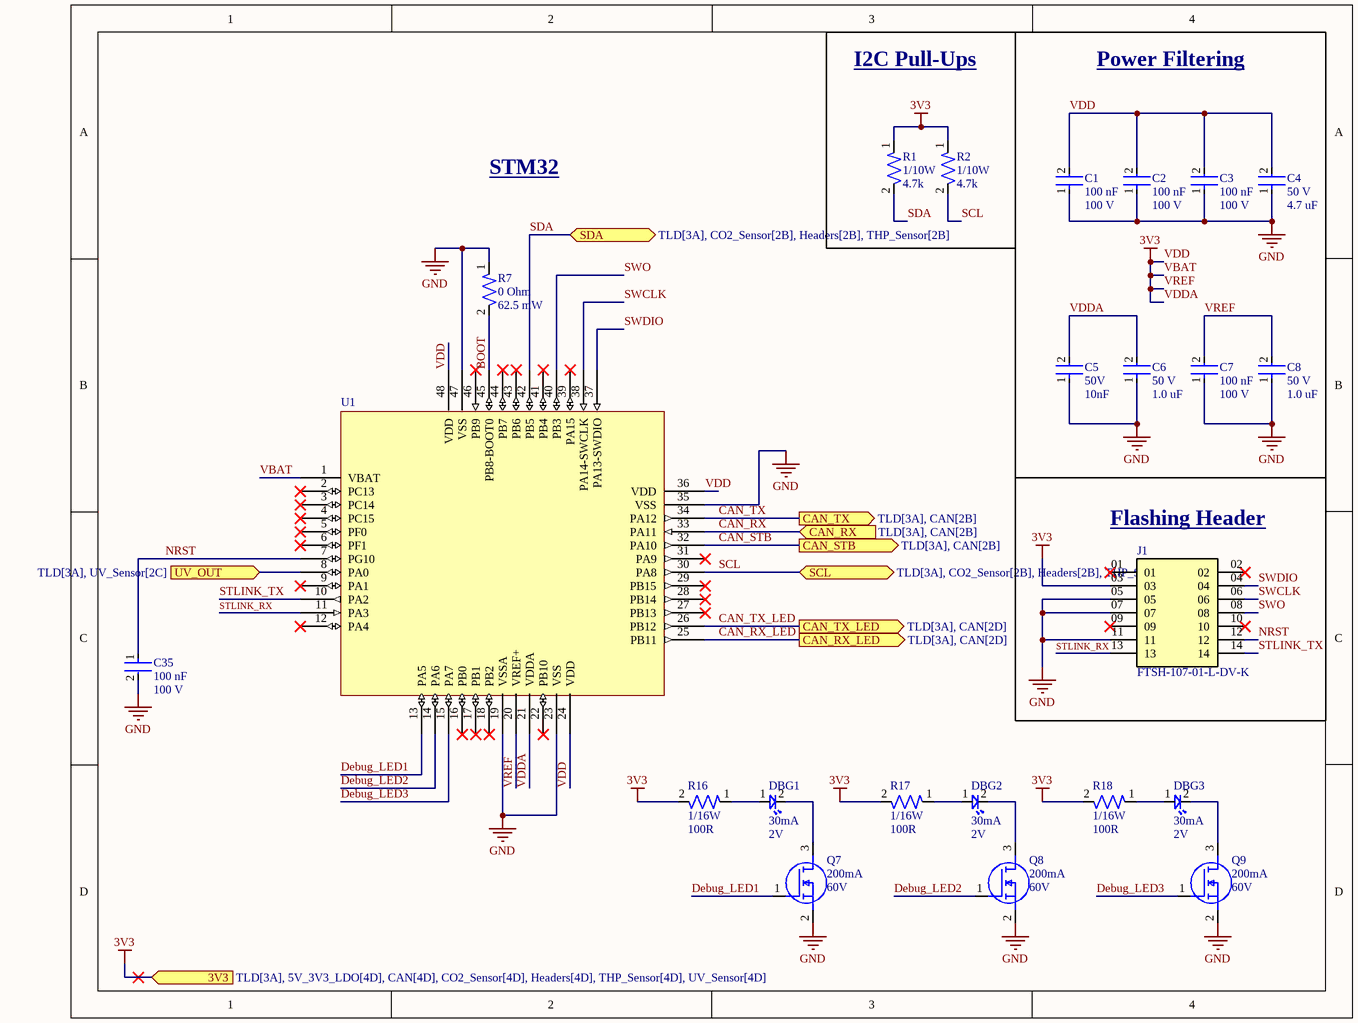
[diagram p6: MCU.SchDoc]

### Parts
C1  Capacitance: 100 nF  Voltage: 100 V  [CAP-0603]  (hidden comment: CC0603KRX7R0BB104)
C2  Capacitance: 100 nF  Voltage: 100 V  [CAP-0603]  (hidden comment: CC0603KRX7R0BB104)
C3  Capacitance: 100 nF  Voltage: 100 V  [CAP-0603]  (hidden comment: CC0603KRX7R0BB104)
C4  Voltage: 50 V  Capacitance: 4.7 uF  [CAP-0805]  (hidden comment: CC0805KKX5R9BB475)
C5  Voltage: 50V  Capacitance: 10nF  [CAP-0805]  (hidden comment: GRM2195C1H103JA01D)
C6  Voltage: 50 V  Capacitance: 1.0 uF  [CAP-0805]  (hidden comment: CC0805KKX7R9BB105)
C7  Capacitance: 100 nF  Voltage: 100 V  [CAP-0603]  (hidden comment: CC0603KRX7R0BB104)
C8  Voltage: 50 V  Capacitance: 1.0 uF  [CAP-0805]  (hidden comment: CC0805KKX7R9BB105)
C35  Capacitance: 100 nF  Voltage: 100 V  [CAP-0603]  (hidden comment: CC0603KRX7R0BB104)
DBG1  Forward Current: 30mA  Forward Voltage: 2V  [LED-0603]  (hidden comment: BL-HKC36G-AV-TRB)
DBG2  Forward Current: 30mA  Forward Voltage: 2V  [LED-0603]  (hidden comment: BL-HKC36G-AV-TRB)
DBG3  Forward Current: 30mA  Forward Voltage: 2V  [LED-0603]  (hidden comment: BL-HKC36G-AV-TRB)
J1  FTSH-107-01-L-DV-K  [SAMTEC_FTSH-107-01-L-DV-K]
Q7  Continuous Current: 200mA  Voltage: 60V  [IC-SOT23-3]  (hidden comment: T2N7002AK,LM)
Q8  Continuous Current: 200mA  Voltage: 60V  [IC-SOT23-3]  (hidden comment: T2N7002AK,LM)
Q9  Continuous Current: 200mA  Voltage: 60V  [IC-SOT23-3]  (hidden comment: T2N7002AK,LM)
R1  Power: 1/10W  Resistance: 4.7k  [RES-0603]  (hidden comment: RC0603FR-074K7L)
R2  Power: 1/10W  Resistance: 4.7k  [RES-0603]  (hidden comment: RC0603FR-074K7L)
R7  Resistance: 0 Ohm  Power: 62.5 mW  [RES-0402]  (hidden comment: RC0402FR-070RL)
R16  Power: 1/16W  Resistance: 100R  [RES-0402]  (hidden comment: RC0402FR-07100RL)
R17  Power: 1/16W  Resistance: 100R  [RES-0402]  (hidden comment: RC0402FR-07100RL)
R18  Power: 1/16W  Resistance: 100R  [RES-0402]  (hidden comment: RC0402FR-07100RL)
U1  STM32G431CBT6  [IC-LQFP48]  (value not drawn)

### Blocks framed on the sheet
I2C Pull-Ups: R1 R2
Power Filtering: C1-C8
Flashing Header: J1

### Ports
3V3 (in, see TLD[3A], 5V_3V3_LDO[4D], CAN[4D], CO2_Sensor[4D], Headers[4D], THP_Sensor[4D], UV_Sensor[4D]), CAN_RX (in, see TLD[3A], CAN[2B]), CAN_RX_LED (out, see TLD[3A], CAN[2D]), CAN_STB (out, see TLD[3A], CAN[2B]), CAN_TX (out, see TLD[3A], CAN[2B]), CAN_TX_LED (out, see TLD[3A], CAN[2D]), SCL (bidir, see TLD[3A], CO2_Sensor[2B], Headers[2B], THP_Sensor[2B]), SDA (bidir, see TLD[3A], CO2_Sensor[2B], Headers[2B], THP_Sensor[2B]), UV_OUT (in, see TLD[3A], UV_Sensor[2C])

### Nets
3V3: C1.2 C2.2 C3.2 C4.2 C5.2 C6.2 C7.2 C8.2 J1.03 R1.1 R2.1 R16.2 R17.2 R18.2 U1.1(VBAT) U1.20(VREF+) U1.21(VDDA) U1.24(VDD) U1.36(VDD) U1.48(VDD) ; port 3V3  [also labelled VBAT, VDD, VDDA, VREF]
GND: C1.1 C2.1 C3.1 C4.1 C5.1 C6.1 C7.1 C8.1 C35.2 J1.05 J1.07 J1.11 Q7.2(S) Q8.2(S) Q9.2(S) R7.1 U1.19(VSSA) U1.23(VSS) U1.35(VSS) U1.47(VSS)
BOOT: R7.2 U1.45(PB8-BOOT0)
CAN_RX: U1.33(PA11) ; port CAN_RX
CAN_RX_LED: U1.25(PB11) ; port CAN_RX_LED
CAN_STB: U1.32(PA10) ; port CAN_STB
CAN_TX: U1.34(PA12) ; port CAN_TX
CAN_TX_LED: U1.26(PB12) ; port CAN_TX_LED
Debug_LED1: Q7.1(G) U1.13(PA5)
Debug_LED2: Q8.1(G) U1.14(PA6)
Debug_LED3: Q9.1(G) U1.15(PA7)
NRST: C35.1 J1.12 U1.7(PG10)
SCL: R2.2 U1.30(PA8) ; port SCL
SDA: R1.2 U1.42(PB5) ; port SDA
STLINK_RX: J1.13 U1.11(PA3)
STLINK_TX: J1.14 U1.10(PA2)
SWCLK: J1.06 U1.38(PA14-SWCLK)
SWDIO: J1.04 U1.37(PA13-SWDIO)
SWO: J1.08 U1.40(PB3)
UV_OUT: U1.8(PA0) ; port UV_OUT
NetDBG1_1: DBG1.1 R16.1
NetDBG1_2: DBG1.2 Q7.3(D)
NetDBG2_1: DBG2.1 R17.1
NetDBG2_2: DBG2.2 Q8.3(D)
NetDBG3_1: DBG3.1 R18.1
NetDBG3_2: DBG3.2 Q9.3(D)

Not connected (* = marked no-connect by the designer): J1 01* 02* 09* 10*; U1 2(PC13)* 3(PC14)* 4(PC15)* 5(PF0)* 6(PF1)* 9(PA1)* 12(PA4)* 16(PB0)* 17(PB1)* 18(PB2)* 22(PB10)* 27(PB13)* 28(PB14)* 29(PB15)* 31(PA9)* 39(PA15)* 41(PB4)* 43(PB6)* 44(PB7)* 46(PB9)*

### Notes on the sheet
- STM32

### Library data of the parts
C1-C3 C7 C35 = CAP-100N-0001: CAP CER 0.1UF 100V X7R 0603; Device Class: Ceramic; Size: 0603; ComponentLink1Description: Datasheet; ComponentLink1URL: https://www.yageo.com/upload/media/product/app/datasheet/mlcc/upy-np0x7r_mv_100-to-630v.pdf
C4 = CAP-4.7U-0002: CAP CER 4.7UF 50V X5R 0805; ComponentLink2Description: Datasheet; ComponentLink2URL: http://www.yageo.com/documents/recent/UPY-GPHC_Y5V_6.3V-to-50V_8.pdf; Device Class: Ceramic; Size: 0805
C5 = CAP-10N-0001: CAP CER 10000PF 50V C0G/NP0 0805; Device Class: Ceramic; Size: 0805; ComponentLink1Description: Datasheet; ComponentLink1URL: https://search.murata.co.jp/Ceramy/image/img/A01X/G101/ENG/GRM2195C1H103JA01-01.pdf
C6 C8 = CAP-1U-0001: CAP CER 1UF 50V X7R 0805; ComponentLink2URL: https://www.yageo.com/upload/media/product/productsearch/datasheet/mlcc/UPY-GPHC_X7R_6.3V-to-250V_24.pdf; ComponentLink2Description: Datasheet; Device Class: Ceramic; Size: 0805
DBG1-DBG3 = LED-0001: LED YELLOW CLEAR 0603 SMD; ComponentLink1Description: Datasheet; ComponentLink1URL: https://www.americanbrightled.com/pdffiles/led-components/smt/BL-HKC36G-AV-TRB.pdf
J1 = CONN_Flashing-0001: Connector Header Surface Mount 14 position 0.050" (1.27mm); MF: Samtec; Value: *; Price: None; Package: None; Availability: Unavailable; MP: FTSH-107-01-L-DV-K; ComponentLink1Description: Datasheet; ComponentLink1URL: https://mm.digikey.com/Volume0/opasdata/d220001/medias/docus/6209/ftsh-1xx-xx-xxx-dv-xxx-xxx-x-xx-mkt.pdf
Q7-Q9 = NMOS-200MA-0001: MOSFET N-CH 60V 200MA SOT23; ComponentLink1Description: Datasheet; ComponentLink1URL: https://toshiba.semicon-storage.com/info/T2N7002AK_datasheet_en_20150401.pdf?did=29712&prodName=T2N7002AK
R1 R2 = RES-4.7k-0001: RES 4.7K OHM 1% 1/10W 0603; Tolerance: 1%; Size: 0603; ComponentLink1Description: Datasheet; ComponentLink1URL: https://www.yageo.com/upload/media/product/products/datasheet/rchip/PYu-RC_Group_51_RoHS_L_12.pdf
R7 = RES-0-0002-JLC: 62.5mW Thick Film Resistors 50V -55℃~+155℃ 0Ω 0402 Chip Resistor - Surface Mount ROHS; assembled?: yes; JLC part number: C106231
R16-R18 = RES-100-0001: RES 100 OHM 1% 1/16W 0402; Tolerance: 1%; Size: 0402; ComponentLink1Description: Datasheet; ComponentLink1URL: https://www.yageo.com/upload/media/product/products/datasheet/rchip/PYu-RC_Group_51_RoHS_L_12.pdf
U1 = IC-STM32G431CBT6: IC MCU 32BIT 128KB FLASH 48LQFP; Package: 48LQFP; ComponentLink1Description: Datasheet; ComponentLink1URL: https://www.st.com/resource/en/datasheet/stm32g431cb.pdf

## Sheet THP_Sensor.SchDoc
size A; SheetNumber: 9; SheetTotal: 10
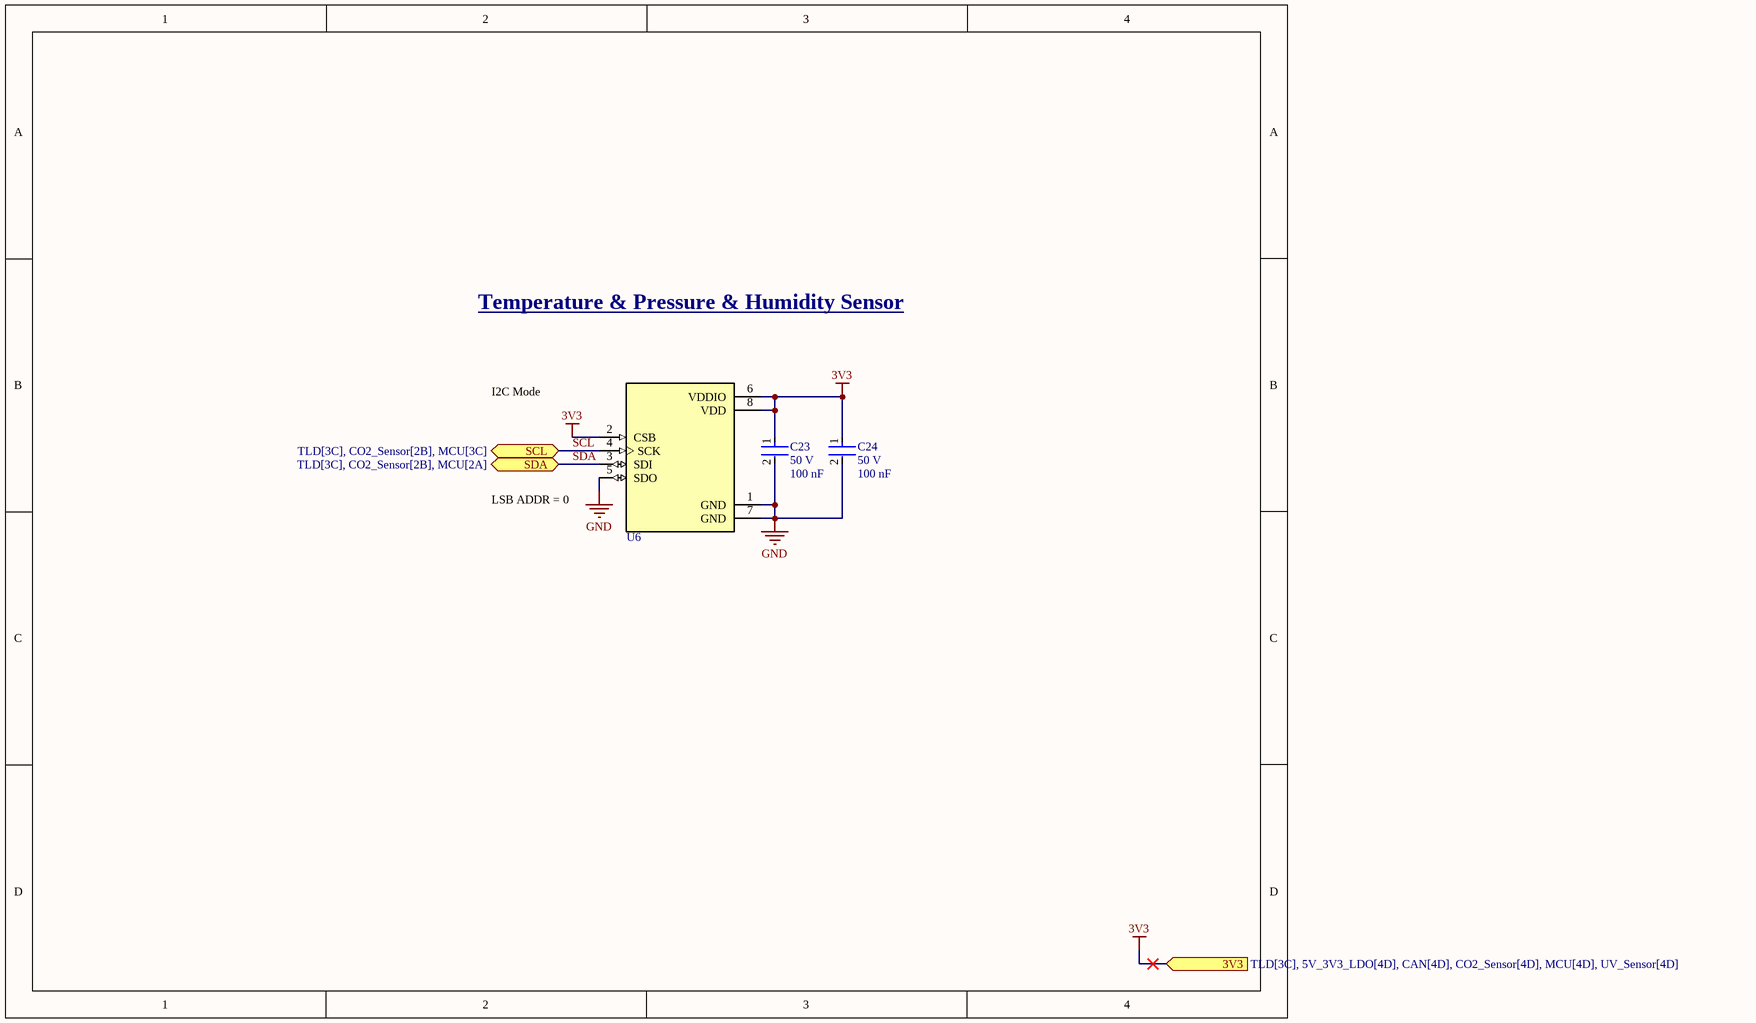
[diagram p7: THP_Sensor.SchDoc]

### Parts
C23  Voltage Rating: 50 V  Capacitance: 100 nF  [CAP-0805]  (hidden comment: CC0805KRX7R9BB104)
C24  Voltage Rating: 50 V  Capacitance: 100 nF  [CAP-0805]  (hidden comment: CC0805KRX7R9BB104)
U6  BME280  [PSON65P250X250X100-8N]  (value not drawn)

### Ports
3V3 (in, see TLD[3C], 5V_3V3_LDO[4D], CAN[4D], CO2_Sensor[4D], MCU[4D], UV_Sensor[4D]), SCL (bidir, see TLD[3C], CO2_Sensor[2B], MCU[3C]), SDA (bidir, see TLD[3C], CO2_Sensor[2B], MCU[2A])

### Nets
3V3: C23.1 C24.1 U6.2(CSB) U6.6(VDDIO) U6.8(VDD) ; port 3V3
GND: C23.2 C24.2 U6.1(GND) U6.5(SDO) U6.7(GND)
SCL: U6.4(SCK) ; port SCL
SDA: U6.3(SDI) ; port SDA

### Notes on the sheet
- Temperature & Pressure & Humidity Sensor
- (near U6) I2C Mode
- (near U6) LSB ADDR = 0

### Library data of the parts
C23 C24 = CAP-0.1U-0002: CAP CER 0.1UF 50V X7R 0805; ComponentLink2Description: Datasheet; ComponentLink2URL: https://www.yageo.com/upload/media/product/productsearch/datasheet/mlcc/UPY-GPHC_X7R_6.3V-to-250V_24.pdf; Device Class: Ceramic; Size: 0805
U6 = SENS-Temp-Press-Humid: DIGITAL HUMIDITY, PRESSURE AND TEMPERATURE SENSOR<br>* Digital interface IÂ²C (up to 3.4 MHz) and SPI (3 and 4 wire, up to 10 MHz)* Supply voltage VDD main supply voltage range: 1.71 V to 3.6 V*VDDIO interface voltage range: 1.2 V to 3.6 V<br> Operating range -40â€¦+85 Â°C, 0â€¦100 % rel. humidity, 300â€¦1100 hPa <br><br>  The library has been designed by<a href="https://www.facebook.com/groups/eaglecadsoftUK"> Richard Magdycz</a>; Package: None; Availability: Unavailable; MP: BME280; Value: *; Price: None; ComponentLink1Description: Datasheet; ComponentLink1URL: https://www.bosch-sensortec.com/media/boschsensortec/downloads/datasheets/bst-bme280-ds002.pdf

## Sheet UV_Sensor.SchDoc
size A; SheetNumber: 7; SheetTotal: 10
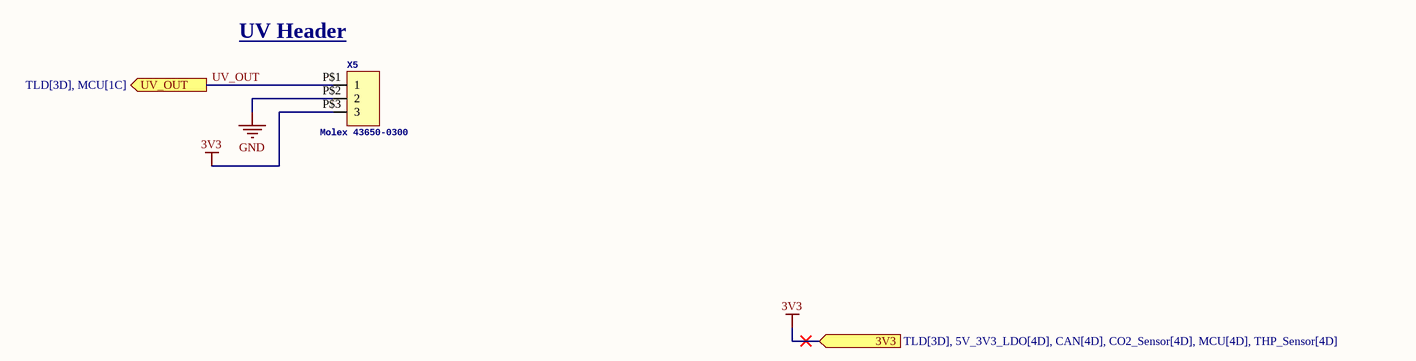
[diagram p8: UV_Sensor.SchDoc]

### Parts
X5  Molex 43650-0300  [43650-0300]

### Ports
3V3 (in, see TLD[3D], 5V_3V3_LDO[4D], CAN[4D], CO2_Sensor[4D], MCU[4D], THP_Sensor[4D]), UV_OUT (out, see TLD[3D], MCU[1C])

### Nets
3V3: X5.P$3(3) ; port 3V3
GND: X5.P$2(2)
UV_OUT: X5.P$1(1) ; port UV_OUT

### Notes on the sheet
- (near X5) UV Header

### Library data of the parts
X5 = Micro-Fit Molex 3 Pin Right Angle: as X1 on sheet CAN; DeviceName: 43650-0300; LibraryName: con-molex-micro-fit-3_0_2; Package: 43650-0300

## Sheet Headers.SchDoc
size A; SheetNumber: 10; SheetTotal: 10
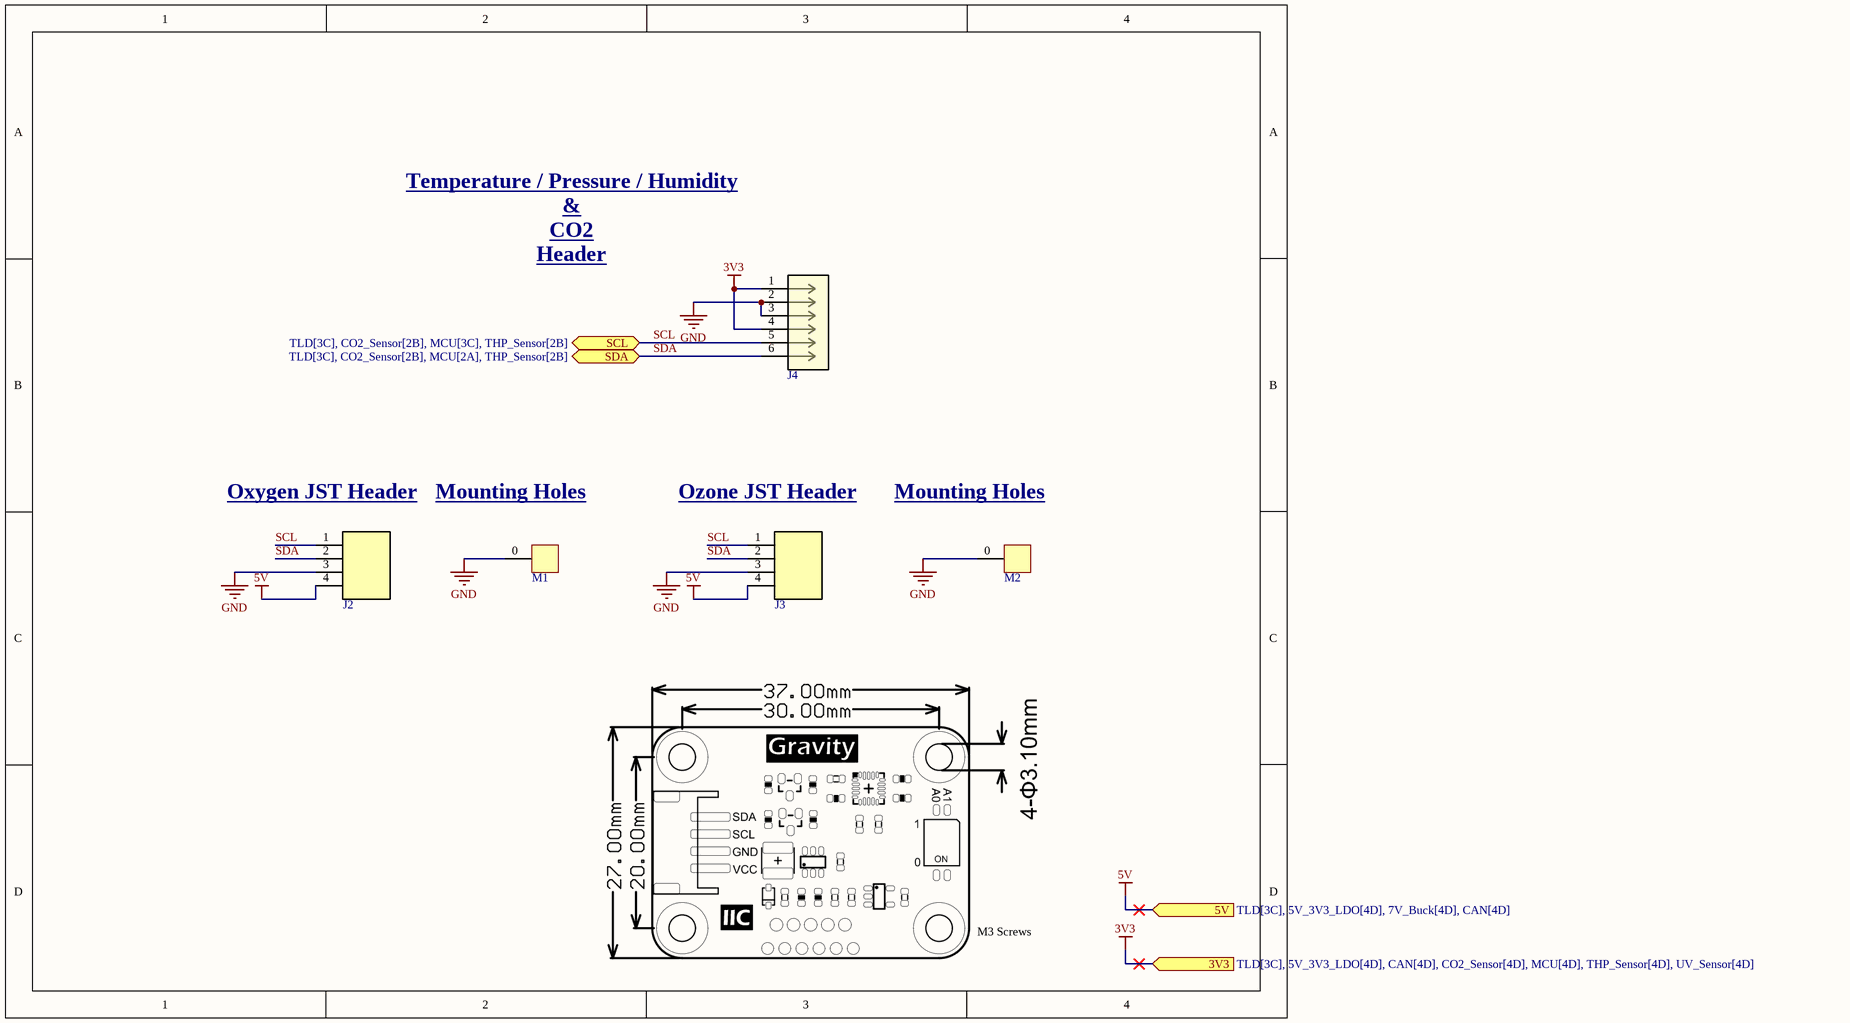
[diagram p9: Headers.SchDoc]

### Parts
J2  S4B-PH-SM4-TB  [JST_S4B-PH-SM4-TB]  (value not drawn)
J3  S4B-PH-SM4-TB  [JST_S4B-PH-SM4-TB]  (value not drawn)
J4  430450600  [CONN_SD-43045-001_06_MOL]  (value not drawn)
M1  DK-Oxygen  [DK-Oxygen]  (value not drawn)
M2  DK-Ozone  [DK-Ozone]  (value not drawn)

### Ports
3V3 (in, see TLD[3C], 5V_3V3_LDO[4D], CAN[4D], CO2_Sensor[4D], MCU[4D], THP_Sensor[4D], UV_Sensor[4D]), 5V (in, see TLD[3C], 5V_3V3_LDO[4D], 7V_Buck[4D], CAN[4D]), SCL (bidir, see TLD[3C], CO2_Sensor[2B], MCU[3C], THP_Sensor[2B]), SDA (bidir, see TLD[3C], CO2_Sensor[2B], MCU[2A], THP_Sensor[2B])

### Nets
3V3: J4.1 J4.4 ; port 3V3
5V: J2.4 J3.4 ; port 5V
GND: J2.3 J3.3 J4.2 J4.3 M1.0 M2.0
SCL: J2.1 J3.1 J4.5 ; port SCL
SDA: J2.2 J3.2 J4.6 ; port SDA

### Notes on the sheet
- (near J4) Temperature / Pressure / Humidity
  &
  CO2
  Header
- (near J2) Oxygen JST Header
- (near M1) Mounting Holes
- (near J3) Ozone JST Header
- (near M2) Mounting Holes
- M3 Screws

### Library data of the parts
J2 J3 = CONN-4POS-JST-0001: Connector Header Surface Mount, Right Angle 4 position 0.079 (2.00mm); MF: JST Sales; SnapEDA_Link: https://www.snapeda.com/parts/S4B-PH-SM4-TB/JST/view-part/?ref=snap; Package: None; Value: *; MP: S4B-PH-SM4-TB; Check_prices: https://www.snapeda.com/parts/S4B-PH-SM4-TB/JST/view-part/?ref=eda; ComponentLink1Description: Datasheet; ComponentLink1URL: https://www.jst-mfg.com/product/pdf/eng/ePH.pdf
J4 = CONN_6POS_430450600: Micro-Fit 3.0 Right-Angle Header, 3.00mm Pitch, Dual Row, 6 Circuits, with Snap-in Plastic Peg PCB Lock, Tin, Glow-Wire Capable, Black; Manufacturer_Name: Molex Connector Corporation; Copyright: Copyright (C) 2025 Ultra Librarian. All rights reserved.; Manufacturer_Part_Number: 430450600; RefDes: RefDes; Type: Type

## Nets that join several sheets
3V3: 5V_3V3_LDO (5 pins), CAN (C26.1 R9.2 R10.2 U2.5), CO2_Sensor (C22.1 U5.6), MCU (20 pins), THP_Sensor (5 pins), UV_Sensor (X5.P$3), Headers (J4.1 J4.4)
5V: 5V_3V3_LDO (6 pins), CAN (C25.1 U2.3), Headers (J2.4 J3.4)
7V: 5V_3V3_LDO (5 pins), 7V_Buck (7 pins)
GND: 5V_3V3_LDO (12 pins), 7V_Buck (13 pins), CAN (7 pins), CO2_Sensor (7 pins), Input_Power (11 pins), MCU (20 pins), THP_Sensor (5 pins), UV_Sensor (X5.P$2), Headers (6 pins)
VBAT: 7V_Buck (6 pins), Input_Power (F1.2)
CAN_RX: CAN (U2.4), MCU (U1.33)
CAN_RX_LED: CAN (Q4.1), MCU (U1.25)
CAN_STB: CAN (U2.8), MCU (U1.32)
CAN_TX: CAN (U2.1), MCU (U1.34)
CAN_TX_LED: CAN (Q3.1), MCU (U1.26)
SCL: CO2_Sensor (U5.4), MCU (R2.2 U1.30), THP_Sensor (U6.4), Headers (J2.1 J3.1 J4.5)
SDA: CO2_Sensor (U5.7), MCU (R1.2 U1.42), THP_Sensor (U6.3), Headers (J2.2 J3.2 J4.6)
UV_OUT: MCU (U1.8), UV_Sensor (X5.P$1)